# Altium schematic sheet 20210915_EleksTube_IPS_midextend.SchDoc
size A4
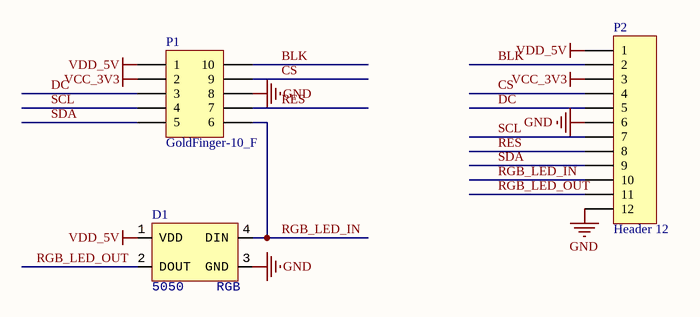
[diagram p0: 20210915_EleksTube_IPS_midextend.SchDoc]

## Parts
D1  Type: 5050  [LED_5050_WS2812B]  (hidden comment: RGB)
P1  GoldFinger-10_F  [GoldFinger-10_F]
P2  Header 12  [SIP12-1.27]

## Nets
GND: D1.3(GND) P1.8 P2.6 P2.12
VCC_3V3: P1.2 P2.3
VDD_5V: D1.1(VDD) P1.1 P2.1
BLK: P1.10 P2.2
CS: P1.9 P2.4
DC: P1.3 P2.5
RES: P1.7 P2.8
RGB_LED_IN: D1.4(DIN) P1.6 P2.10
RGB_LED_OUT: D1.2(DOUT) P2.11
SCL: P1.4 P2.7
SDA: P1.5 P2.9

## Library data of the parts
D1 = LED_5050_WS2812B: LED; Value: RGB
P1 = GoldFinger-10_F: Header, 5-Pin, Dual row; LatestRevisionDate: 17-Jul-2002; LatestRevisionNote: Re-released for DXP Platform.; Publisher: Altium Limited
P2 = Header 12: Header, 12-Pin; LatestRevisionDate: 17-Jul-2002; LatestRevisionNote: Re-released for DXP Platform.; Publisher: Altium Limited